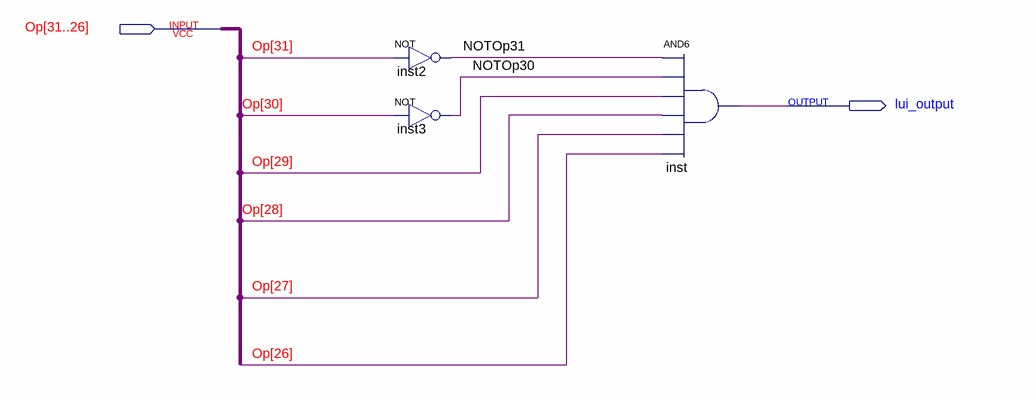
[diagram p0: schematic sheet]
// Quartus schematic LUI.bdf as structural Verilog: 3 symbols, 2 pins
module LUI (
  input  [31:26] Op,
  output lui_output
);

  wire NOTOp30, NOTOp31;

  not inst2 (NOTOp31, Op[31]);
  not inst3 (NOTOp30, Op[30]);
  and inst (lui_output, NOTOp31, NOTOp30, Op[29], Op[28], Op[27], Op[26]);
endmodule
